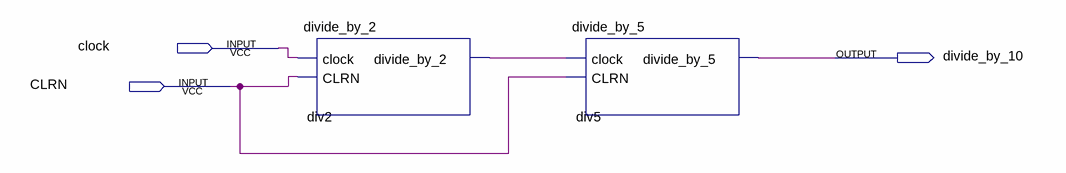
[diagram p0: schematic sheet]
// Quartus schematic divide_by_10.bdf as structural Verilog: 2 symbols, 3 pins
module divide_by_10 (
  input  clock,
  input  CLRN,
  output divide_by_10
);

  wire div2_divide_by_2;

  divide_by_2 div2 (.clock(clock), .CLRN(CLRN), .divide_by_2(div2_divide_by_2));
  divide_by_5 div5 (.clock(div2_divide_by_2), .CLRN(CLRN), .divide_by_5(divide_by_10));
endmodule
